# EAGLE design MeteoV4.1 (EAGLE 9.6.2)
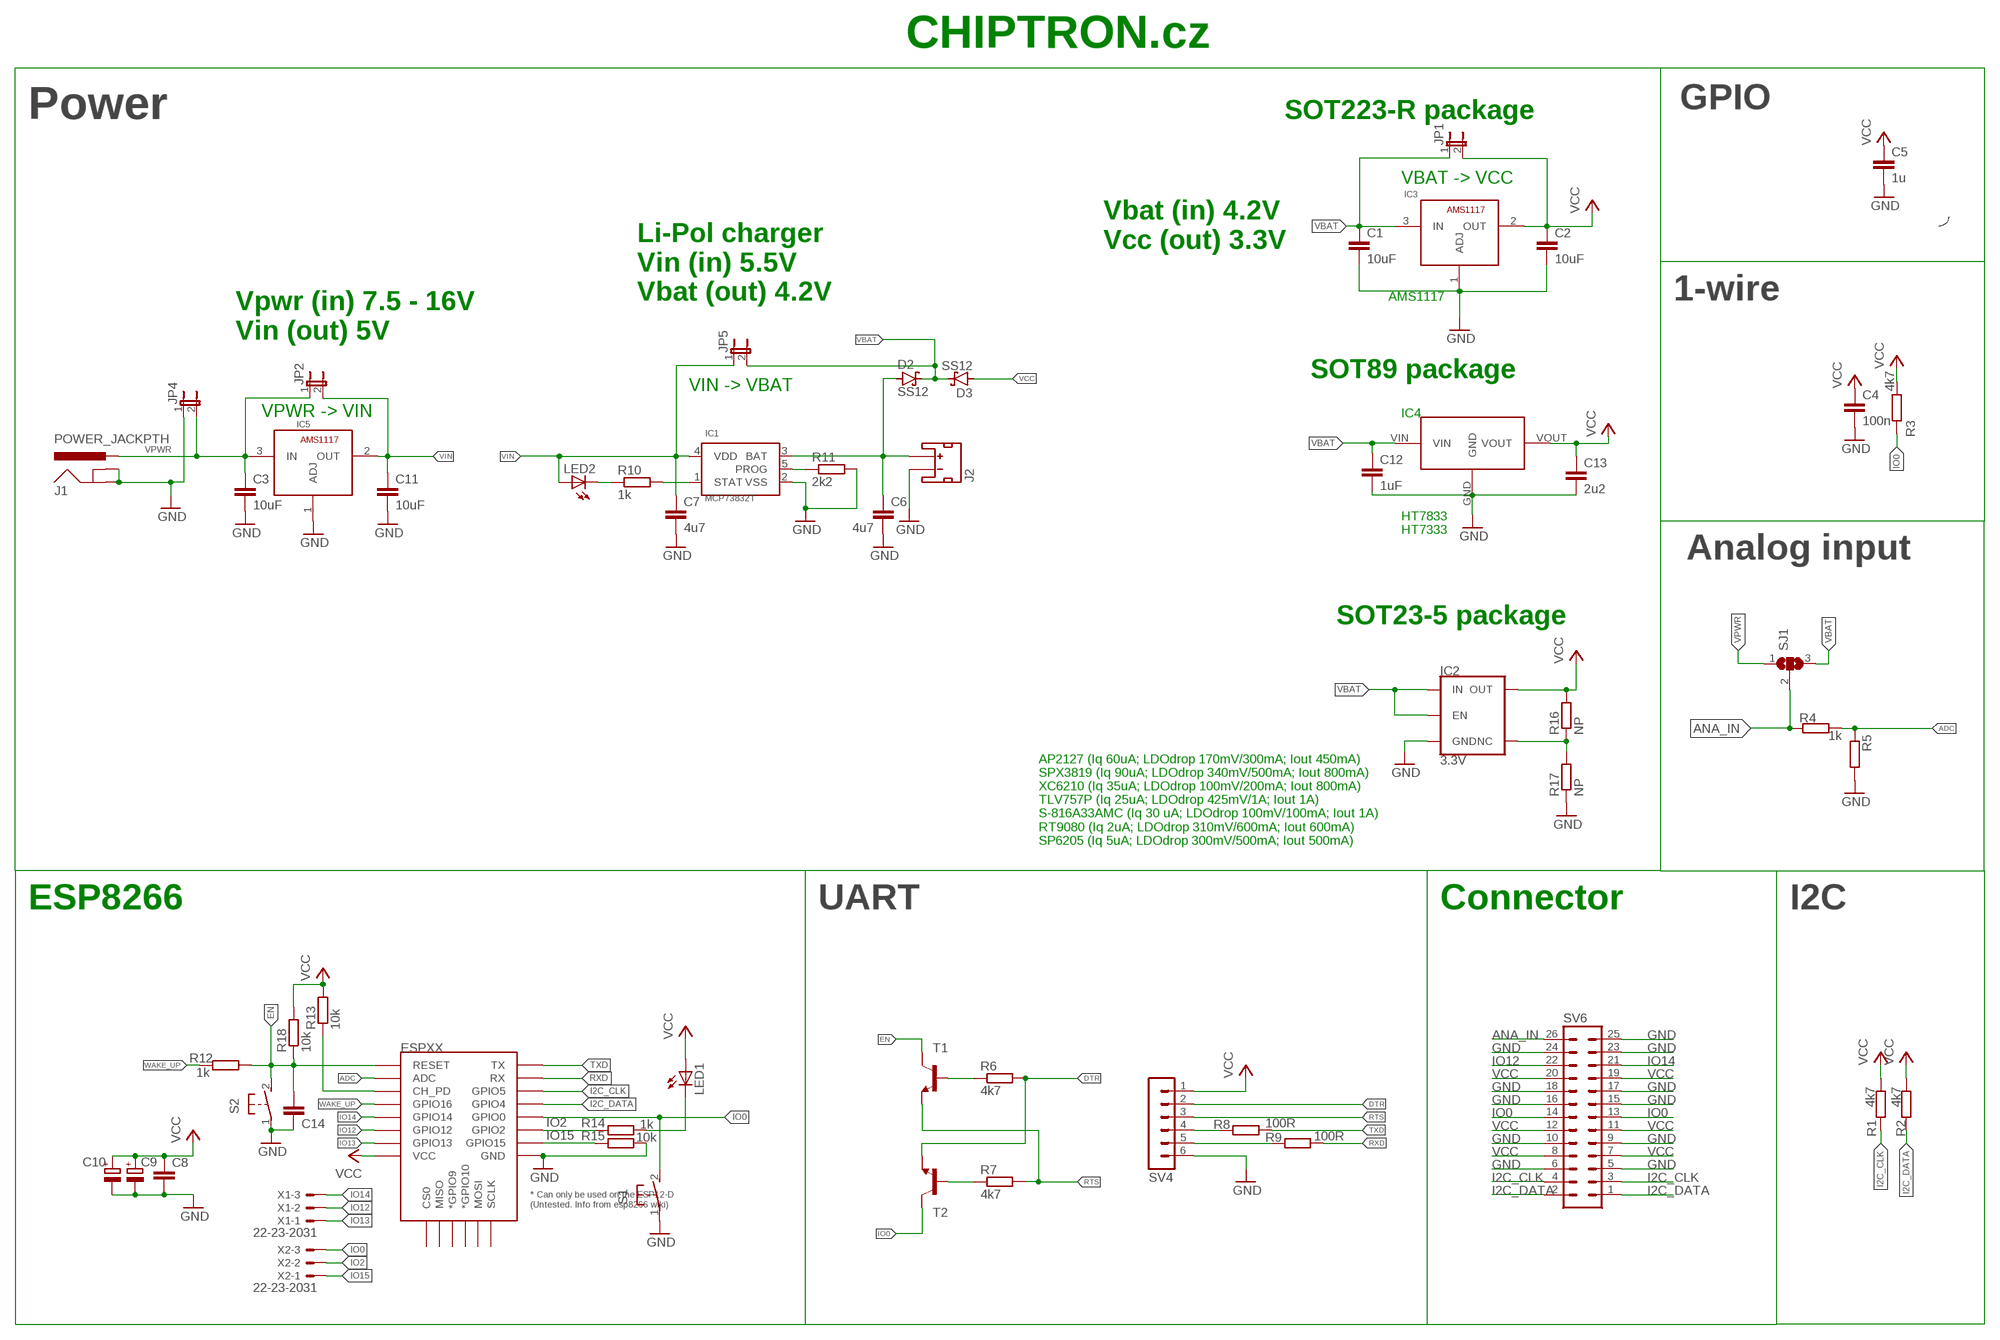
[diagram p0: schematic, sheet 1]

## Parts
C1  10uF  C-EUC0805  [C0805]
C2  10uF  C-EUC0805  [C0805]
C3  10uF  C-EUC0805  [C0805]
C4  100n  C-EUC0805  [C0805]
C5  1u  C-EUC0805  [C0805]
C6  4u7  C-EUC0805  [C0805]
C7  4u7  C-EUC0805  [C0805]
C8  C-EUC0805  [C0805]
C9  CPOL-EUSMCB  [SMC_B]
C10  CPOL-EUSMCC  [SMC_C]
C11  10uF  C-EUC0805  [C0805]
C12  1uF  C-EUC0805  [C0805]
C13  2u2  C-EUC0805  [C0805]
C14  C-EUC0805  [C0805]
D2  SS12  [SMA]
D3  SS12  [SMA]
ESPXX  ESP12ESMD  [ESP12E-SMD]
IC1  MCP73832T  [SOT23-5]
IC2  3.3V  V_REG_AP2112K-3.3V  [SOT23-5]
IC3  AMS1117  [SOT-223-3]
IC4  HT7333  [SOT89]
IC5  AMS1117  [SOT-223-3]
J1  POWER_JACKPTH  [POWER_JACK_PTH]
J2  JST_2MM_MALE  [JST-2-SMD]
JP1  JP1E  [JP1]
JP2  JP1E  [JP1]
JP4  JP1E  [JP1]
JP5  JP1E  [JP1]
LED1  LEDCHIP-LED0805  [CHIP-LED0805]
LED2  LEDCHIP-LED0805  [CHIP-LED0805]
R1  4k7  R-EU_M0805  [M0805]
R2  4k7  R-EU_M0805  [M0805]
R3  4k7  R-EU_M0805  [M0805]
R4  1k  R-EU_M0805  [M0805]
R5  R-EU_M0805  [M0805]
R6  4k7  R-EU_M0805  [M0805]
R7  4k7  R-EU_M0805  [M0805]
R8  100R  R-EU_M0805  [M0805]
R9  100R  R-EU_M0805  [M0805]
R10  1k  R-EU_M0805  [M0805]
R11  2k2  R-EU_M0805  [M0805]
R12  1k  R-EU_M0805  [M0805]
R13  10k  R-EU_M0805  [M0805]
R14  1k  R-EU_M0805  [M0805]
R15  10k  R-EU_M0805  [M0805]
R16  NP  R-EU_M0805  [M0805]
R17  NP  R-EU_M0805  [M0805]
R18  10k  R-EU_M0805  [M0805]
S1  31-XX  [B3F-31XX]
S2  31-XX  [B3F-31XX]
SJ1  SJ2W  [SJ_2]
SV4  MA06-1  [MA06-1]
SV6  MA13-2  [MA13-2]
T1  BC846-NPN-SOT23-BEC  [SOT23-BEC]
T2  BC846-NPN-SOT23-BEC  [SOT23-BEC]
X1  22-23-2031  [22-23-2031]
X2  22-23-2031  [22-23-2031]

## Nets
ADC: ESPXX.ADC R4.1 R5.1
ANA_IN: R4.2 SJ1.2 SV6.26
DTR: R6.2 SV4.2 T2.E
EN: C14.1 ESPXX.RESET R12.1 R18.1 S2.2(S) T1.C
GND: C1.2 C2.2 C3.2 C4.2 C5.2 C6.2 C7.2 C8.2 C9.- C10.- C11.2 C12.2 C13.2 C14.2 ESPXX.GND IC1.2(VSS) IC2.2(GND) IC3.1(ADJ) IC4.GND IC5.1(ADJ) J1.GND J1.GNDBREAK J2.1(-) JP4.1 R5.2 R11.2 R15.1 R17.1 S1.1(P) S2.1(P) SV4.6 SV6.5 SV6.6 SV6.9 SV6.10 SV6.15 SV6.16 SV6.17 SV6.18 SV6.23 SV6.24 SV6.25
I2C_CLK: ESPXX.GPIO5 R1.1 SV6.3 SV6.4
I2C_DATA: ESPXX.GPIO4 R2.1 SV6.1 SV6.2
IO0: ESPXX.GPIO0 R3.1 S1.2(S) SV6.13 SV6.14 T2.C X2.3
IO2: ESPXX.GPIO2 R14.2 X2.2
IO12: ESPXX.GPIO12 SV6.22 X1.2
IO13: ESPXX.GPIO13 X1.1
IO14: ESPXX.GPIO14 SV6.21 X1.3
IO15: ESPXX.GPIO15 R15.2 X2.1
N$2: R7.1 T2.B
N$3: R8.1 SV4.4
N$4: R9.1 SV4.5
N$5: IC1.5(PROG) R11.1
N$7: ESPXX.CH_PD R13.1
N$8: LED1.C R14.1
N$11: IC2.4(NC) R16.1 R17.2
N$12: R6.1 T1.B
N$14: IC1.1(STAT) R10.2
N$16: LED2.C R10.1
N$35: C6.1 D2.A IC1.3(BAT) J2.2(+)
RTS: R7.2 SV4.3 T1.E
RXD: ESPXX.RXD0(RX) R9.2
TXD: ESPXX.TXD0(TX) R8.2
VBAT: C1.1 C12.1 D2.C D3.C IC2.1(IN) IC2.3(EN) IC3.3(IN) IC4.VIN JP1.1 JP5.2 SJ1.3
VCC: C2.1 C4.1 C5.1 C8.1 C9.+ C10.+ C13.1 D3.A ESPXX.VCC IC2.5(OUT) IC3.2(OUT) IC4.VOUT JP1.2 LED1.A R1.2 R2.2 R3.2 R13.2 R16.2 R18.2 SV4.1 SV6.7 SV6.8 SV6.11 SV6.12 SV6.19 SV6.20
VIN: C7.1 C11.1 IC1.4(VDD) IC5.2(OUT) JP2.2 JP5.1 LED2.A
VPWR: C3.1 IC5.3(IN) J1.PWR JP2.1 JP4.2 SJ1.1
WAKE_UP: ESPXX.GPIO16 R12.2
Unconnected: ESPXX.CS0 ESPXX.GPIO9(*GPIO9) ESPXX.GPIO10(*GPIO10) ESPXX.MISO ESPXX.MOSI ESPXX.SCLK J2.NC1(PAD1) J2.NC2(PAD2)

## Notes on the sheet
- CHIPTRON.cz
- Power | GPIO
- SOT223-R package
- VBAT -> VCC
- Vbat (in) 4.2V
  Vcc (out) 3.3V
- Li-Pol charger
  Vin (in) 5.5V
  Vbat (out) 4.2V
- AMS1117 | 1-wire
- Vpwr (in) 7.5 - 16V
  Vin (out) 5V
- SOT89 package
- VIN -> VBAT
- VPWR -> VIN | IC4
- HT7833
  HT7333
- Analog input
- SOT23-5 package
- AP2127 (Iq 60uA; LDOdrop 170mV/300mA; Iout 450mA)
  SPX3819 (Iq 90uA; LDOdrop 340mV/500mA; Iout 800mA)
  XC6210 (Iq 35uA; LDOdrop 100mV/200mA; Iout 800mA)
  TLV757P (Iq 25uA; LDOdrop 425mV/1A; Iout 1A)
  S-816A33AMC (Iq 30 uA; LDOdrop 100mV/100mA; Iout 1A)
  RT9080 (Iq 2uA; LDOdrop 310mV/600mA; Iout 600mA)
  SP6205 (Iq 5uA; LDOdrop 300mV/500mA; Iout 500mA)
- ESP8266 | UART | Connector | I2C

## Library data of the parts
C1-C8 C11-C14 = rcl:C-EU: CAPACITOR, European symbol; SPICEPREFIX: C
C9 C10 = rcl:CPOL-EU: POLARIZED CAPACITOR, European symbol; SPICEPREFIX: C
D2 D3 = Diodes:SS12: DIODE SCHOTTKY 20V 1A SMA Manufacturer's datasheet <https://www.onsemi.com/pub/Collateral/SS19-D.PDF>; CREATED_BY: PCBLayout.com; DIGIKEY_PART_NUMBER: SS12FSCT-ND; MANUFACTURER: ON Semiconductor; MPN: SS12; PACKAGE: SMA (DO-214AC)
ESPXX = esp8266modules:ESP12E: ESP12E Module
IC1 = chiptron_cz:MCP73832T: MCP73832T
IC2 = SparkFun-IC-Power:V_REG_AP2112: AP2112 - 600mA CMOS LDO Regulator w/ Enable The AP2112 is CMOS process low dropout linear regulator with enable function, the regulator delivers a guaranteed 600mA (min.) continuous load current. Features Output Voltage Accuracy: ±1.5% Output Current: 600mA (Min.) Foldback Short Current Protection: 50mA Enable Function to Turn ON/OFF VOUT Low Dropout Voltage (3.3V): 250mV (Typ.) @IOUT=600mA Excellent Load Regulation: 0.2%/A (Typ.) Excellent Line Regulation: 0.02%/V (Typ.) Low Quiescent Current: 55μA (Typ.) Low Standby Current: 0.01μA (Typ.) Low Output Noise: 50μVRMS PSRR: 100Hz -65dB, 1kHz -65dB OTSD Protection Stable with 1.0μF Flexible Cap: Ceramic, Tantalum and Aluminum Electrolytic Operation Temperature Range: -40°C to 85°C ESD: MM 400V, HBM 4000V; PROD_ID: VREG-12457
IC3 IC5 = fabo_powersupply:AMS1117
IC4 = HT7333_SOT89:HT7333
J1 = SparkFun:POWER_JACK: Power Jack This is the standard 5.5mm barrel jack for power. The PTH is the most common, proven, reliable, footprint. All others are experimental. The Slot footprint only works if the mill layer is transmitted to the PCB fab house so be warned. Spark Fun Electronics SKU : PRT-00119. Mating wall wart : TOL-00298 (and others)
J2 = SparkFun-connectors:JST_2MM_MALE: JST 2MM MALE RA CONNECTOR Two pin, compact surface mount connector. Commonly used as a battery input connection point. We really like the solid locking feeling and high current rating on these small connectors. We use these all the time as battery connectors. Mates to single-cell LiPo batteries. Here is the connector we sell at SparkFun: JST Right Angle Connector - White <https://www.sparkfun.com/products/8612> (PRT-08612) Datasheet <http://www.sparkfun.com/datasheets/Prototyping/Connectors/JST-Horizontal.pdf> It was used on these SparkFun products: SparkFun MOSFET Power Controller <https://www.sparkfun.com/products/11214> (PRT-11214) SparkFun Battery Babysitter - LiPo Battery Manager <https://www.sparkfun.com/products/13777> (PRT-13777) And many, many others that required a lipo battery connection.; PROD_ID: CONN-11443; SF_ID: PRT-08612
JP1 JP2 JP4 JP5 = jumper:JP1E: JUMPER
LED1 LED2 = adafruit:LED: LED OSRAM: - CHIPLED LG R971, LG N971, LY N971, LG Q971, LY Q971, LO R971, LY R971 LH N974, LH R974 LS Q976, LO Q976, LY Q976 LO Q996 - Hyper CHIPLED LW Q18S LB Q993, LB Q99A, LB R99A - SideLED LS A670, LO A670, LY A670, LG A670, LP A670 LB A673, LV A673, LT A673, LW A673 LH A674 LY A675 LS A676, LA A676, LO A676, LY A676, LW A676 LS A679, LY A679, LG A679 - Hyper Micro SIDELED® LS Y876, LA Y876, LO Y876, LY Y876 LT Y87S - SmartLED LW L88C, LW L88S LB L89C, LB L89S, LG L890 LS L89K, LO L89K, LY L89K LS L896, LA L896, LO L896, LY L896 - TOPLED LS T670, LO T670, LY T670, LG T670, LP T670 LSG T670, LSP T670, LSY T670, LOP T670, LYG T670 LG T671, LOG T671, LSG T671 LB T673, LV T673, LT T673, LW T673 LH T674 LS T676, LA T676, LO T676, LY T676, LB T676, LH T676, LSB T676, LW T676 LB T67C, LV T67C, LT T67C, LS T67K, LO T67K, LY T67K, LW E67C LS E67B, LA E67B, LO E67B, LY E67B, LB E67C, LV E67C, LT E67C LW T67C LS T679, LY T679, LG T679 LS T770, LO T770, LY T770, LG T770, LP T770 LB T773, LV T773, LT T773, LW T773 LH T774 LS E675, LA E675, LY E675, LS T675 LS T776, LA T776, LO T776, LY T776, LB T776 LHGB T686 LT T68C, LB T68C - Hyper Mini TOPLED® LB M676 - Mini TOPLED Santana® LG M470 LS M47K, LO M47K, LY M47K Source: http://www.osram.convergy.de/
R1-R18 = rcl:R-EU_: RESISTOR, European symbol; SPICEPREFIX: R
S1 S2 = switch-omron:31-XX: OMRON SWITCH; MPN: B3F-3100; OC_FARNELL: 959704; OC_NEWARK: 36M3582
SJ1 = jumper:SJ2W: SMD solder JUMPER
SV4 = con-lstb:MA06-1: PIN HEADER; OC_FARNELL: unknown; OC_NEWARK: unknown
SV6 = con-lstb:MA13-2: PIN HEADER; OC_FARNELL: unknown; OC_NEWARK: unknown
T1 T2 = transistor:*-NPN-: NPN Transistror BF959 corrected 2008.03.06
X1 X2 = con-molex:22-23-2031: .100" (2.54mm) Center Header - 3 Pin; MF: MOLEX; MPN: 22-23-2031; OC_FARNELL: 1462950; OC_NEWARK: 30C0862

## Board
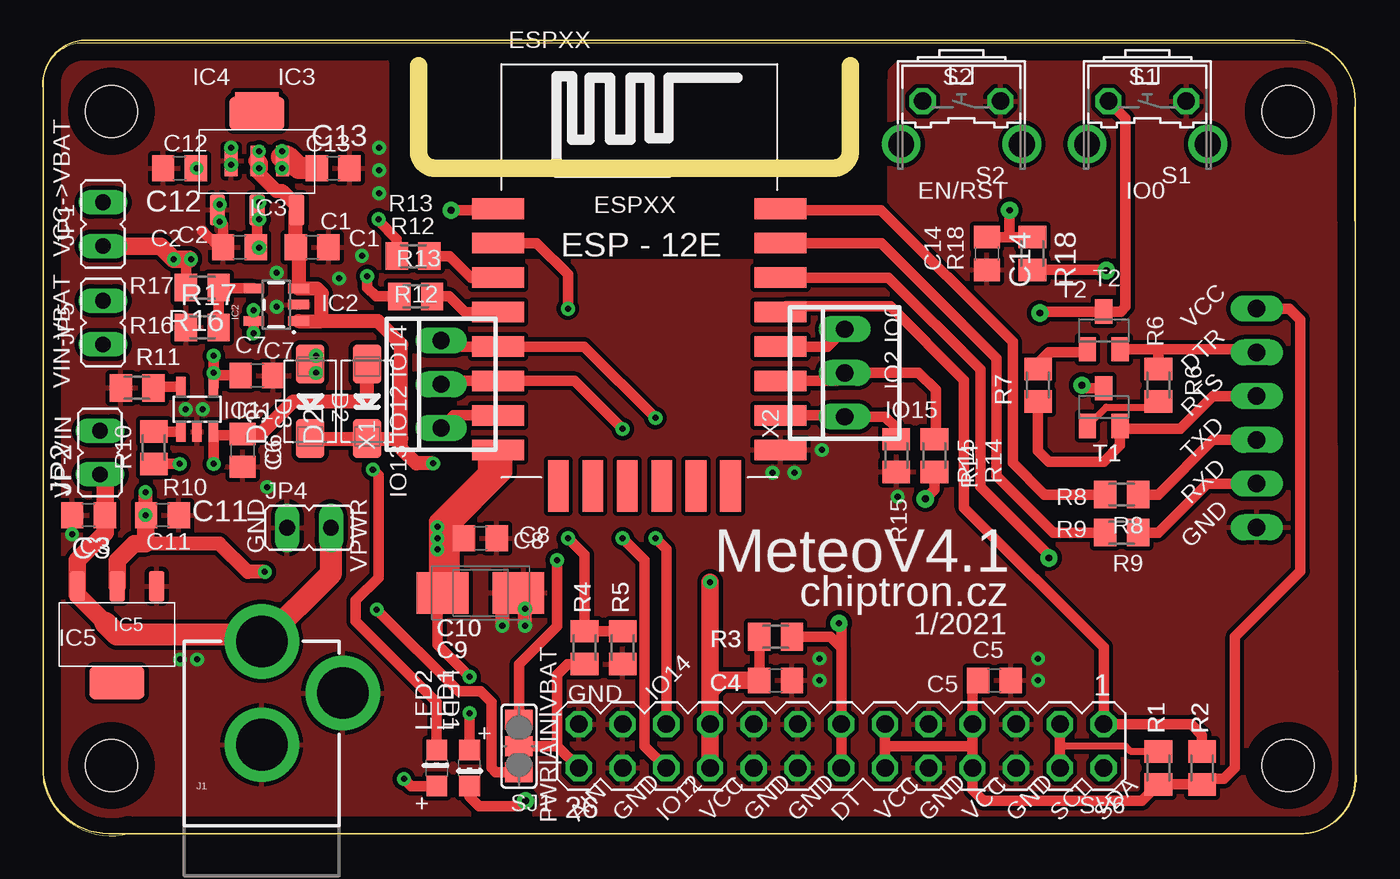
[diagram p1: board, top side]
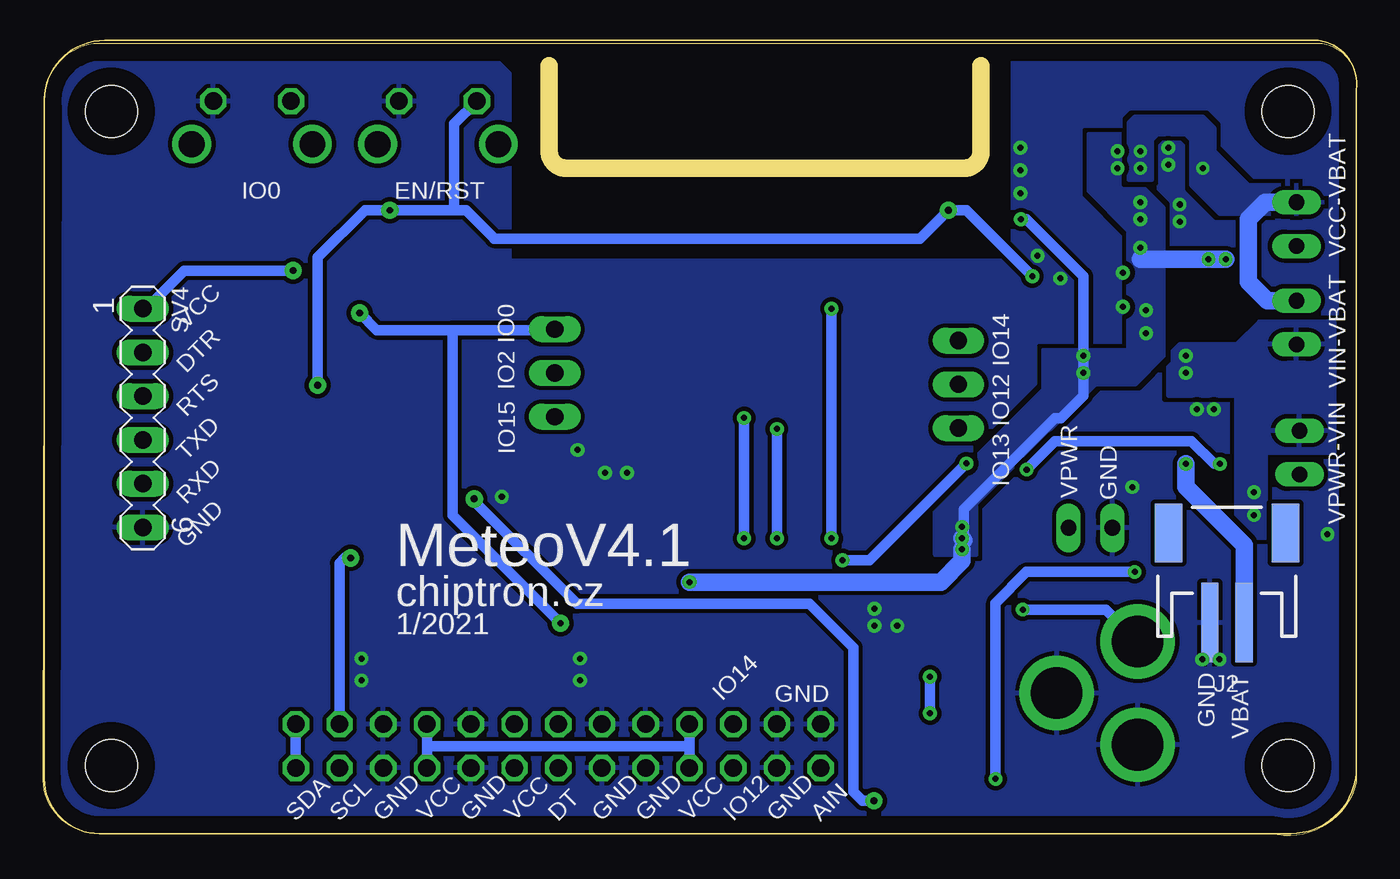
[diagram p2: board, bottom side, seen from below]

Size 76.28 x 46.02 mm. Coordinates in mm from the lower left corner, seen from the top.
Outline: 4.96,0.12 73.21,0.12 arc90 76.28,3.52 76.28,3.09 76.19,42.18 arc90 73.34,46.02 2.19,46.02 arc90 0.01,43.5 0.01,3.09 arc90 4.96,0.12
Copper layers (1*16): Top 0.035mm / dielectric 1.5mm / Bottom 0.035mm
Design rules "default": minimum track width 6mil, minimum drill 0.35mm, track to track 6mil, track to pad 6mil, pad to pad 6mil, via to via 6mil, smd to smd 6mil, copper to edge 40mil, drill to drill 6mil, minimum pad ring 10mil, minimum via ring 8mil, stop-mask expansion 4mil, vias tented up to drill 0mil, thermal gap 10mil
Holes 3 mm at 3.97,4.08 72.32,4.08 3.97,42.06 72.32,42.06
Milling: 13 lines

### Footprints (pad centres in the part's own frame; a part is rotated, then mirrored left to right if it is on the bottom)
C0805 = smd 1.3 x 1.5: 1 -0.95,0; 2 0.95,0
SMC_B = smd 1.6 x 2.4: + -1.5,0; - 1.5,0
SMC_C = smd 2.4 x 2.4: + -2.5,0; - 2.5,0
SMA = smd 2.28 x 1.66: A 2.165,0; C -2.165,0
ESP12E-SMD = smd 3 x 1.2: ADC -8.3,3.8; CH_PD -8.3,1.8; GND 8.1,-8.2; GPIO0 8.1,-2.2; GPIO2 8.1,-4.2; GPIO4 8.1,-0.2; GPIO5 8.1,1.8; GPIO12 -8.3,-4.2; GPIO13 -8.3,-6.2; GPIO14 -8.3,-2.2; GPIO15 8.1,-6.2; GPIO16 -8.3,-0.2; RESET -8.3,5.8; RXD0 8.1,3.8; TXD0 8.1,5.8; VCC -8.3,-8.2 | smd 1.2 x 3: CS0 -4.8,-10.3; GPIO9 -0.8,-10.3; GPIO10 1.2,-10.3; MISO -2.8,-10.3; MOSI 3.2,-10.3; SCLK 5.2,-10.3
SOT23-5 = smd 0.55 x 1.2: 1 -0.95,-1.3; 2 0,-1.3; 3 0.95,-1.3; 4 0.95,1.3; 5 -0.95,1.3
SOT-223-3 = smd 0.9 x 1.8: 1 -2.3,-2.8; 2 0,-2.8; 3 2.3,-2.8 | smd 3.2 x 1.9: 4 0,2.8
SOT89 = smd 0.762 x 1.778: GND -1.499,-0.597; VIN 0,-0.597; VOUT 1.499,-0.597 | smd 2.54 x 1.27: P$4 0,2.743
POWER_JACK_PTH = drill 2.997 pad 4.318: GND 0,7.7; GNDBREAK 4.7,10.7; PWR 0,13.7
JST-2-SMD = smd 1 x 4.6: 1 -1,-3.7; 2 1,-3.7 | smd 1.6 x 3.4: NC1 -3.4,1.5; NC2 3.4,1.5
JP1 = drill 0.914 long: 1 0,-1.27; 2 0,1.27
CHIP-LED0805 = smd 1.2 x 1.2: A 0,-1.05; C 0,1.05
M0805 = smd 1.3 x 1.6: 1 -0.95,0; 2 0.95,0
B3F-31XX = drill 1.016 octagon: 1 -2.261,-1.245; 2 2.261,-1.245 | drill 1.499 pad 2.159: 3 -3.505,1.245; 4 3.505,1.245
SJ_2 = smd 1.168 x 1.6: 1 -1.524,0; 2 0,0; 3 1.524,0
MA06-1 = drill 1.016 long: 1 -6.35,0; 2 -3.81,0; 3 -1.27,0; 4 1.27,0; 5 3.81,0; 6 6.35,0
MA13-2 = drill 1.016 octagon: 1 -15.24,-1.27; 2 -15.24,1.27; 3 -12.7,-1.27; 4 -12.7,1.27; 5 -10.16,-1.27; 6 -10.16,1.27; 7 -7.62,-1.27; 8 -7.62,1.27; 9 -5.08,-1.27; 10 -5.08,1.27; 11 -2.54,-1.27; 12 -2.54,1.27; 13 0,-1.27; 14 0,1.27; 15 2.54,-1.27; 16 2.54,1.27; 17 5.08,-1.27; 18 5.08,1.27; 19 7.62,-1.27; 20 7.62,1.27; 21 10.16,-1.27; 22 10.16,1.27; 23 12.7,-1.27; 24 12.7,1.27; 25 15.24,-1.27; 26 15.24,1.27
SOT23-BEC = smd 1 x 1.4: B -0.95,-1.1; C 0,1.1; E 0.95,-1.1
22-23-2031 = drill 1 long: 1 -2.54,0; 2 0,0; 3 2.54,0

### Placement (x,y rotation side)
C1  15.63,34.16 0 top
C2  11.41,34.16 180 top
C3  2.65,18.61 180 top
C4  42.55,9.01 0 top
C5  55.25,9.01 0 top
C6  11.59,22.37 270 top
C7  12.43,26.71 0 top
C8  25.41,17.26 0 top
C9  25.41,14.09 0 top
C10  25.41,14.09 0 top
C11  6.94,18.61 0 top
C12  7.93,38.75 180 top
C13  16.85,38.75 0 top
C14  54.82,33.8 270 top
D2  18.83,25.22 90 top
D3  15.52,25.22 90 top
ESPXX  34.73,30.6 0 top
IC1  8.95,24.76 0 top
IC2  13.54,30.83 90 top
IC3  12.43,39.13 0 top
IC4  12.43,39.77 0 top
IC5  4.3,11.68 180 top
J1  12.71,-2.42 0 top
J2  7.52,16.07 0 bottom
JP1  3.49,35.5 180 top
JP2  3.31,22.24 0 top
JP4  15.45,17.87 270 top
JP5  3.49,29.79 0 top
LED1  24.77,3.93 180 top
LED2  22.87,3.93 0 top
R1  64.78,3.93 270 top
R2  67.32,3.93 270 top
R3  42.55,11.55 180 top
R4  31.45,10.91 270 top
R5  33.66,10.91 270 top
R6  64.78,26.15 90 top
R7  57.79,26.15 270 top
R8  62.64,19.8 180 top
R9  62.64,17.6 180 top
R10  6.43,22.52 90 top
R11  5.47,26 180 top
R12  21.65,31.31 0 top
R13  21.49,33.65 180 top
R14  51.77,22.07 90 top
R15  49.56,22.07 90 top
R16  9.25,31.82 180 top
R17  9.25,29.51 0 top
R18  57.46,33.8 270 top
S1  64.14,41.39 180 top
S2  53.35,41.39 180 top
SJ1  27.64,5.2 90 top
SV4  70.49,24.25 270 bottom
SV6  46.36,5.2 180 top
T1  61.6,24.88 0 top
T2  61.6,29.33 0 top
X1  23.12,26.21 90 top
X2  46.56,26.87 90 top

### Tracks (layer width: path | path; a pad name or v marks a point on that pad's centre or on a via)
ADC  (via drill 0.35 pad 0.8)
  Top 0.61: R5.1 R4.1 31.45,16.3 v30.49,17.26 | ESPXX.ADC 28.67,34.4 30.49,32.58 v30.49,30.6
  Bottom 0.61: v30.49,30.6 v30.49,17.26
ANA_IN
  Top 0.61: SJ1.2 29.85,5.2 | 29.85,5.2 SV6.26 | R4.2 30.48,9.96 29.85,9.34 29.85,5.2
DTR
  Top 0.61: T2.E 64.78,28.23 | 64.78,28.23 70.32,28.23 SV4.2 | R6.2 64.78,28.23
EN  (via drill 0.35 pad 0.8, 0.35 pad 1, 0.4 pad 1)
  Top 0.61: ESPXX.RESET 26.34,36.31 v23.7,36.31 | T1.C 60.5,25.98 v60.33,26.15 | R12.1 19.33,31.31 18.83,31.82 v18.83,32.48 | C14.1 56.14,34.75 | 56.14,34.75 R18.1 | 56.14,34.75 v56.14,36.31
  Bottom 0.61: 52.41,36.31 52.41,41.32 S2.2 | v60.33,26.15 60.33,33.57 57.59,36.31 v56.14,36.31 52.41,36.31 | v18.83,32.48 22.66,36.31 v23.7,36.31 25.35,34.66 50.09,34.66 50.09,34.68 51.72,36.31 52.41,36.31
GND  (via drill 0.35 pad 0.8)
  Top 0.61: 9.25,35.12 10.22,34.16 C2.2 10.46,35.46 v10.27,35.65
  Top 0.813: v28,12.18 v28,13.18 | v26.68,12.18 26.68,13.86 C9.-
  other vias: 45.09,9.01 57.79,9.01 49.64,19.68 42.37,21.07 43.64,21.07 45.24,22.4 9.28,24.76 13.01,20.24 57.79,10.28 45.09,10.28 13.57,30.7 10.27,36.65 10.93,38.96 10.93,39.95 7.96,10.23 8.95,10.23 8.29,24.76 19.51,39.95 19.51,38.63 19.51,37.31 13.57,32.68 17.2,32.35 18.52,33.67 1.68,17.49
  pour Top (isolate 0.254, rank 6): 2.14,46.17 18.65,46.17 19.94,44.87 19.94,33.34 49.18,33.34 49.18,43.88 49.21,43.91 49.21,44.37 50.85,46.01 72.65,46.35 arc-90 76.21,42.79 76.21,3.35 arc-90 71.7,-1.16 3.62,-0.2 arc-90 0.01,3.42 0.02,44.05 arc-90
  pour Bottom (isolate 0.254, rank 6): 2.14,46.17 18.65,46.17 19.94,44.87 19.94,33.34 49.18,33.34 49.18,44.21 50.98,46.02 72.65,46.35 arc-90 76.25,42.75 76.25,3.44 arc-90 72.93,0.12 3.64,0.12 arc-90 0.01,3.75 0.01,44.04 arc-90
I2C_CLK  (via drill 0.4 pad 1)
  Top 0.406: R1.1 63.19,4.88 62.87,5.2 59.06,5.2
  Top 0.61: ESPXX.GPIO5 49.11,32.4 54.44,27.07 54.44,20.26 58.43,16.27 v58.43,16.12 | SV6.4 59.06,5.2 SV6.3
  Bottom 0.61: v58.43,16.12 58.76,16.12 59.06,15.82 SV6.3
I2C_DATA
  Top 0.61: ESPXX.GPIO4 43.16,30.73 49.2,30.73 53.5,26.43 53.5,19.04 61.6,10.94 SV6.1 66.68,6.47 67.32,5.83 R2.1
  Bottom 0.61: SV6.2 SV6.1
IO0  (via drill 0.35 pad 1, 0.4 pad 1)
  Top 0.61: S1.2 62.87,41.65 62.87,30.71 62.59,30.43 T2.C 57.98,30.43 v57.89,30.35 | R3.1 45.73,11.55 46.36,10.91 | 46.36,10.91 SV6.13 SV6.14 | 46.36,10.91 46.36,12.21 v46.23,12.34 | X2.3 45.56,28.4 ESPXX.GPIO0
  Bottom 0.61: 52.51,29.35 46.51,29.35 X2.3 | 52.51,29.35 56.9,29.35 v57.89,30.35 | v46.23,12.34 52.51,18.61 52.51,29.35
IO2
  Top 0.61: ESPXX.GPIO2 46.1,26.4 X2.2 50.86,26.87 51.85,25.88 51.85,23.09 R14.2
IO12  (via drill 0.35 pad 0.8)
  Top 0.61: v33.66,23.61 30.88,26.4 ESPXX.GPIO12 23.31,26.4 X1.2 | v33.66,17.26 34.93,15.99 34.93,5.2 SV6.22
  Bottom 0.61: v33.66,23.61 v33.66,17.26
IO13
  Top 0.61: ESPXX.GPIO13 23.85,24.4 X1.1
IO14  (via drill 0.35 pad 0.8)
  Top 0.61: v35.57,24.25 31.42,28.4 ESPXX.GPIO14 23.47,28.4 X1.3 | v35.57,17.26 36.2,16.63 SV6.21
  Bottom 0.61: v35.57,24.25 v35.57,17.26
IO15
  Top 0.61: R15.2 49.56,23.68 48.91,24.33 X2.1 46.49,24.4 ESPXX.GPIO15
N$2
  Top 0.61: T2.B 60.48,28.06 58.43,28.06 57.79,27.42 R7.1
N$3
  Top 0.61: SV4.4 67.95,22.98 64.78,19.8 R8.1
N$4
  Top 0.61: R9.1 64.78,17.59 67.62,20.44 SV4.5
N$5
  Top 0.61: IC1.5 6.47,26.06 R11.1
N$7
  Top 0.61: ESPXX.CH_PD 24.85,32.4 23.6,33.65 R13.1
N$8  (via drill 0.4 pad 1)
  Top 0.61: v28.02,2.02 27.69,1.69 25.32,1.69 24.77,2.24 LED1.C | R14.1 51.77,20.08 v51.24,19.55
  Bottom 0.61: v28.02,2.02 28.68,2.02 29.22,2.56 29.22,10.91 31.76,13.45 45.27,13.45 51.24,19.42 v51.24,19.55
N$11
  Top 0.61: IC2.4 10.24,31.78 R16.1 R17.2
N$12
  Top 0.406: T1.B 61.75,24.88 64.46,24.88 R6.1
N$14
  Top 0.61: IC1.1 6.45,23.46 R10.2
N$16  (via drill 0.35 pad 0.8)
  Top 0.61: LED2.C 22.87,7.74 18.17,12.44 18.17,13.66 19.49,14.98 19.49,20.92 v19.16,21.25 | R10.1 6.76,21.57 6.85,21.49 6.94,21.58 v7.93,21.58
  Bottom 0.61: v7.93,21.58 8.26,21.58 9.58,22.9 17.51,22.9 v19.16,21.25
N$35  (via drill 0.35 pad 0.8)
  Top 0.61: v9.91,21.58 9.91,23.23 | 9.91,23.23 9.91,23.44 IC1.3 | C6.1 11.5,23.23 9.91,23.23
  Top 0.813: C6.1 12.64,23.32 14.53,25.21 18.83,25.21 D2.A
  Bottom 1.016: J2.2 6.52,16.87 9.91,20.26 v9.91,21.58
RTS
  Top 0.61: R7.2 57.79,22.34 58.43,21.71 61.6,21.71 62.55,22.66 T1.E 62.72,23.61 66.05,23.61 67.95,25.52 SV4.3
RXD
  Top 0.61: ESPXX.RXD0 48.68,34.4 55.38,27.7 55.38,20.9 58.68,17.59 R9.2
TXD
  Top 0.61: R8.2 58.17,19.8 56.32,21.66 56.32,28.67 48.67,36.31 42.91,36.31 ESPXX.TXD0
VBAT  (via drill 0.35, 0.35 pad 0.8)
  Top 0.305: v8.92,38.75 8.92,39.08
  Top 0.61: v29.85,15.99 29.85,12.16 27.64,9.95 SJ1.3 | 14.84,33.99 C1.1 | 14.68,36.28 IC3.3
  Top 0.813: 14.84,33.99 IC2.3 15.9,31.78 16.19,31.49 16.19,29.88 | C1.1 14.68,36.28 14.68,36.63 13.87,37.43 13.54,37.43 12.43,38.55 IC4.VIN | D3.C D2.C 20.81,23.05 | v22.66,21.61 21.67,21.61 20.81,22.47 20.81,23.05 | 16.19,29.88 19.46,29.88 20.81,28.53 20.81,23.05 | IC2.1 16.19,29.88 | C12.1 v8.92,38.75
  Top 1.016: IC4.VIN 12.55,39.04 v12.55,38.75
  Bottom 0.61: v22.66,21.61 28.28,15.99 v29.85,15.99
  Bottom 1.016: JP1.1 5.29,36.77 6.28,35.78 6.28,32.15 5.19,31.06 JP5.2
  other vias: 12.55,39.74
  pour Bottom (isolate 0.254): 7.93,36.11 1.99,36.11 1.99,37.76 6.28,37.76 8.26,39.74 8.26,41.06 8.92,41.73 12.88,41.73 13.21,41.39 13.21,38.09 11.89,38.09 11.89,40.4 11.56,40.73 9.91,40.73 9.58,40.4 9.58,37.76
VCC  (via drill 0.35 pad 0.8, 0.4 pad 1)
  Top 0.61: C5.1 53.98,8.69 SV6.7 53.98,5.2 | SV6.12 48.9,5.2 | 48.9,5.2 SV6.11 | C4.1 R3.2 | 53.98,5.2 SV6.8 53.98,2.66 54.62,2.02 63.82,2.02 R1.2 R2.2 67.63,3.29 68.59,3.29 69.22,3.93 69.22,11.55 73.03,15.36 73.03,29.96 72.4,30.6 SV4.1 | 53.98,5.2 48.9,5.2 | v24.77,7.1 LED1.A | v24.77,9.23 22.91,11.1 C10.+ | v19.49,35.78 19.49,35.69 20.54,34.64 R13.2 | D3.A 15.52,27.53 | R16.2 8.3,33.47 8.26,33.51 7.64,33.51 v7.6,33.47 | v15.86,26.87 16.04,26.87 D3.A | D3.A 15.05,27.86 v15.86,27.86 | 12.22,29.88 v12.22,29.18 | IC2.5 12.22,29.88 | v12.22,30.5 12.22,29.88 | v12.55,34.13 12.53,34.16 C2.1 12.43,34.22 IC3.2 12.55,36.21 | v13.87,38.75 13.87,39.12 IC4.VOUT 13.92,39.69 v13.87,39.74 | 14.53,39.41 14.2,39.41 v13.87,39.74 | v13.87,39.74 13.87,39.41 | 12.55,36.21 v12.55,35.78 v12.55,36.77 12.55,36.21 | R18.2 61.71,32.85 v61.75,32.81 | v8.59,33.47 8.49,33.47
  Top 0.813: 23.78,17.26 23.78,14.22 C9.+
  Top 1.016: v22.91,17.26 22.91,17.9 | 22.91,17.9 22.91,18.22 25.77,21.08 25.77,21.74 ESPXX.VCC 26.76,22.07 26.76,21.09 23.46,17.79 | C8.1 23.78,17.26 v22.91,17.26 | v22.91,17.26 23.5,17.26 23.46,17.31 23.46,17.79 | v22.91,17.26 v22.91,16.63 C10.+ C9.+ | 22.91,17.9 23.46,18.45 23.46,17.79 | v38.74,14.72 38.74,8.37 | C4.1 39.38,9.01 38.74,8.37 | 38.74,8.37 SV6.19 SV6.20 | JP1.2 6.84,34.23 v7.6,33.47 8.49,33.47
  Top 1.27: C13.1 14.86,38.75 14.2,39.41 13.87,39.41
  Bottom 0.61: SV6.8 53.98,5.2 | 53.98,5.2 SV6.7 | 53.98,5.2 38.74,5.2 | 38.74,5.2 SV6.19 | SV6.20 38.74,5.2 | v24.77,7.1 v24.77,9.23 | v19.49,35.78 19.16,35.78 15.86,32.48 v15.86,27.86 15.86,25.54 17.18,24.22 17.51,24.22 22.79,18.94 22.79,17.15 | 12.55,33.47 v12.55,34.13 | SV4.1 70.39,30.5 68.08,32.81 v61.75,32.81
  Bottom 1.016: 22.79,17.15 v22.91,17.26 | v22.91,16.63 22.91,15.95 24.14,14.72 v38.74,14.72 | v7.6,33.47 12.55,33.47
  other vias: 22.91,17.93
  pour Bottom (isolate 0.305, rank 2): 15.52,40.73 13.54,40.73 13.54,38.75 11.23,36.44 11.23,27.86 12.88,26.21 15.19,26.21 22.13,19.27 22.13,16.3 24.44,16.3 24.44,19.6 18.17,25.88 18.17,28.19 13.21,28.19 13.21,35.12 15.52,37.43
VIN  (via drill 0.35 pad 0.8)
  Top 0.61: LED2.A 21.38,2.88 v20.96,3.29 | C7.1 9.9,26.72 IC1.4 9.91,26.07 v9.91,27.86
  Top 0.813: 5.95,18.57 C11.1 5.95,18.65 v5.95,19.93 | v12.88,15.31 11.89,15.31 10.24,16.96 5.95,16.96
  Top 1.016: IC5.2 4.3,15.97 4.77,16.44 5.29,16.96 5.95,16.96 5.95,18.57
  Bottom 0.61: v20.96,3.29 20.96,13.51 19.16,15.31 v12.88,15.31
  other vias: 5.95,18.61 9.91,26.87
  pour Bottom (isolate 0.305, rank 3): 5.62,29.84 1.33,29.84 1.33,22.24 5.29,22.24 5.29,17.29 5.95,17.29 6.94,18.28 6.94,25.55 10.9,25.55 10.9,27.86 10.24,28.52 6.94,28.52
VPWR  (via drill 0.35 pad 0.8)
  Top 0.61: SJ1.1 26.29,3.68 26.04,3.93 26.04,7.74 25.41,8.37 24.14,8.37 v19.39,13.12
  Top 1.016: 3.62,12.36 2,13.98 IC5.3 2,15.98 3.6,17.58 C3.1 3.6,20.68 JP2.1
  Top 1.27: 3.62,12.36 4.3,11.68 12.31,11.68 J1.PWR 12.77,11.28 16.72,15.23 JP4.2
  Bottom 0.61: J1.PWR 14.55,13.12 v19.39,13.12
WAKE_UP
  Top 0.61: ESPXX.GPIO16 24.5,30.4 23.59,31.31 R12.2

### Text on the board
_tNames: S2 | S1 | IC4 | IC3 | C12 | C13 | EN/RST | IO0 | R13 | ESPXX | R12 | C2 | C1 | VCC->VBAT | C14 | R18 | R17 | T2 | IC2 | R16 | VCC | C7 | R6 | R11 | R7 | DTR | VIN-VBAT | D2 | IO2 IO0 | IC1 | D3 | IO15 | RTS | C6 | R15 | R14 | T1 | T1 | TXD | R10 | VP-VIN | IO13 IO12 IO14 | R8 | RXD | C3 | C8 | R9 | GND | C11 | GND | VPWR | R4 | R5 | R5 | MeteoV4.1 | chiptron.cz | IC5 | 1/2021 | C10 | C10 | R3 | R3 | LED2 | C9 | C9 | LED1 | GND | IO14 | C4 | C4 | C5 | R1 | R1 | R2 | R2 | PWR|AIN|VBAT | AIN | GND | IO12 | VCC | GND | GND | DT | VCC | GND | VCC | GND | SCL | SDA
_bNames: EN/RST | IO0 | VCC-VBAT | VCC | DTR | VIN-VBAT | IO2 IO0 | VPWR-VIN | IO15 | RTS | TXD | IO13 IO12 IO14 | GND | VPWR | RXD | GND | MeteoV4.1 | chiptron.cz | 1/2021 | VBAT | GND | GND | IO14 | AIN | GND | IO12 | VCC | GND | GND | DT | VCC | GND | VCC | GND | SCL | SDA